# EAGLE schematic source_eagle (EAGLE 9.6.2)
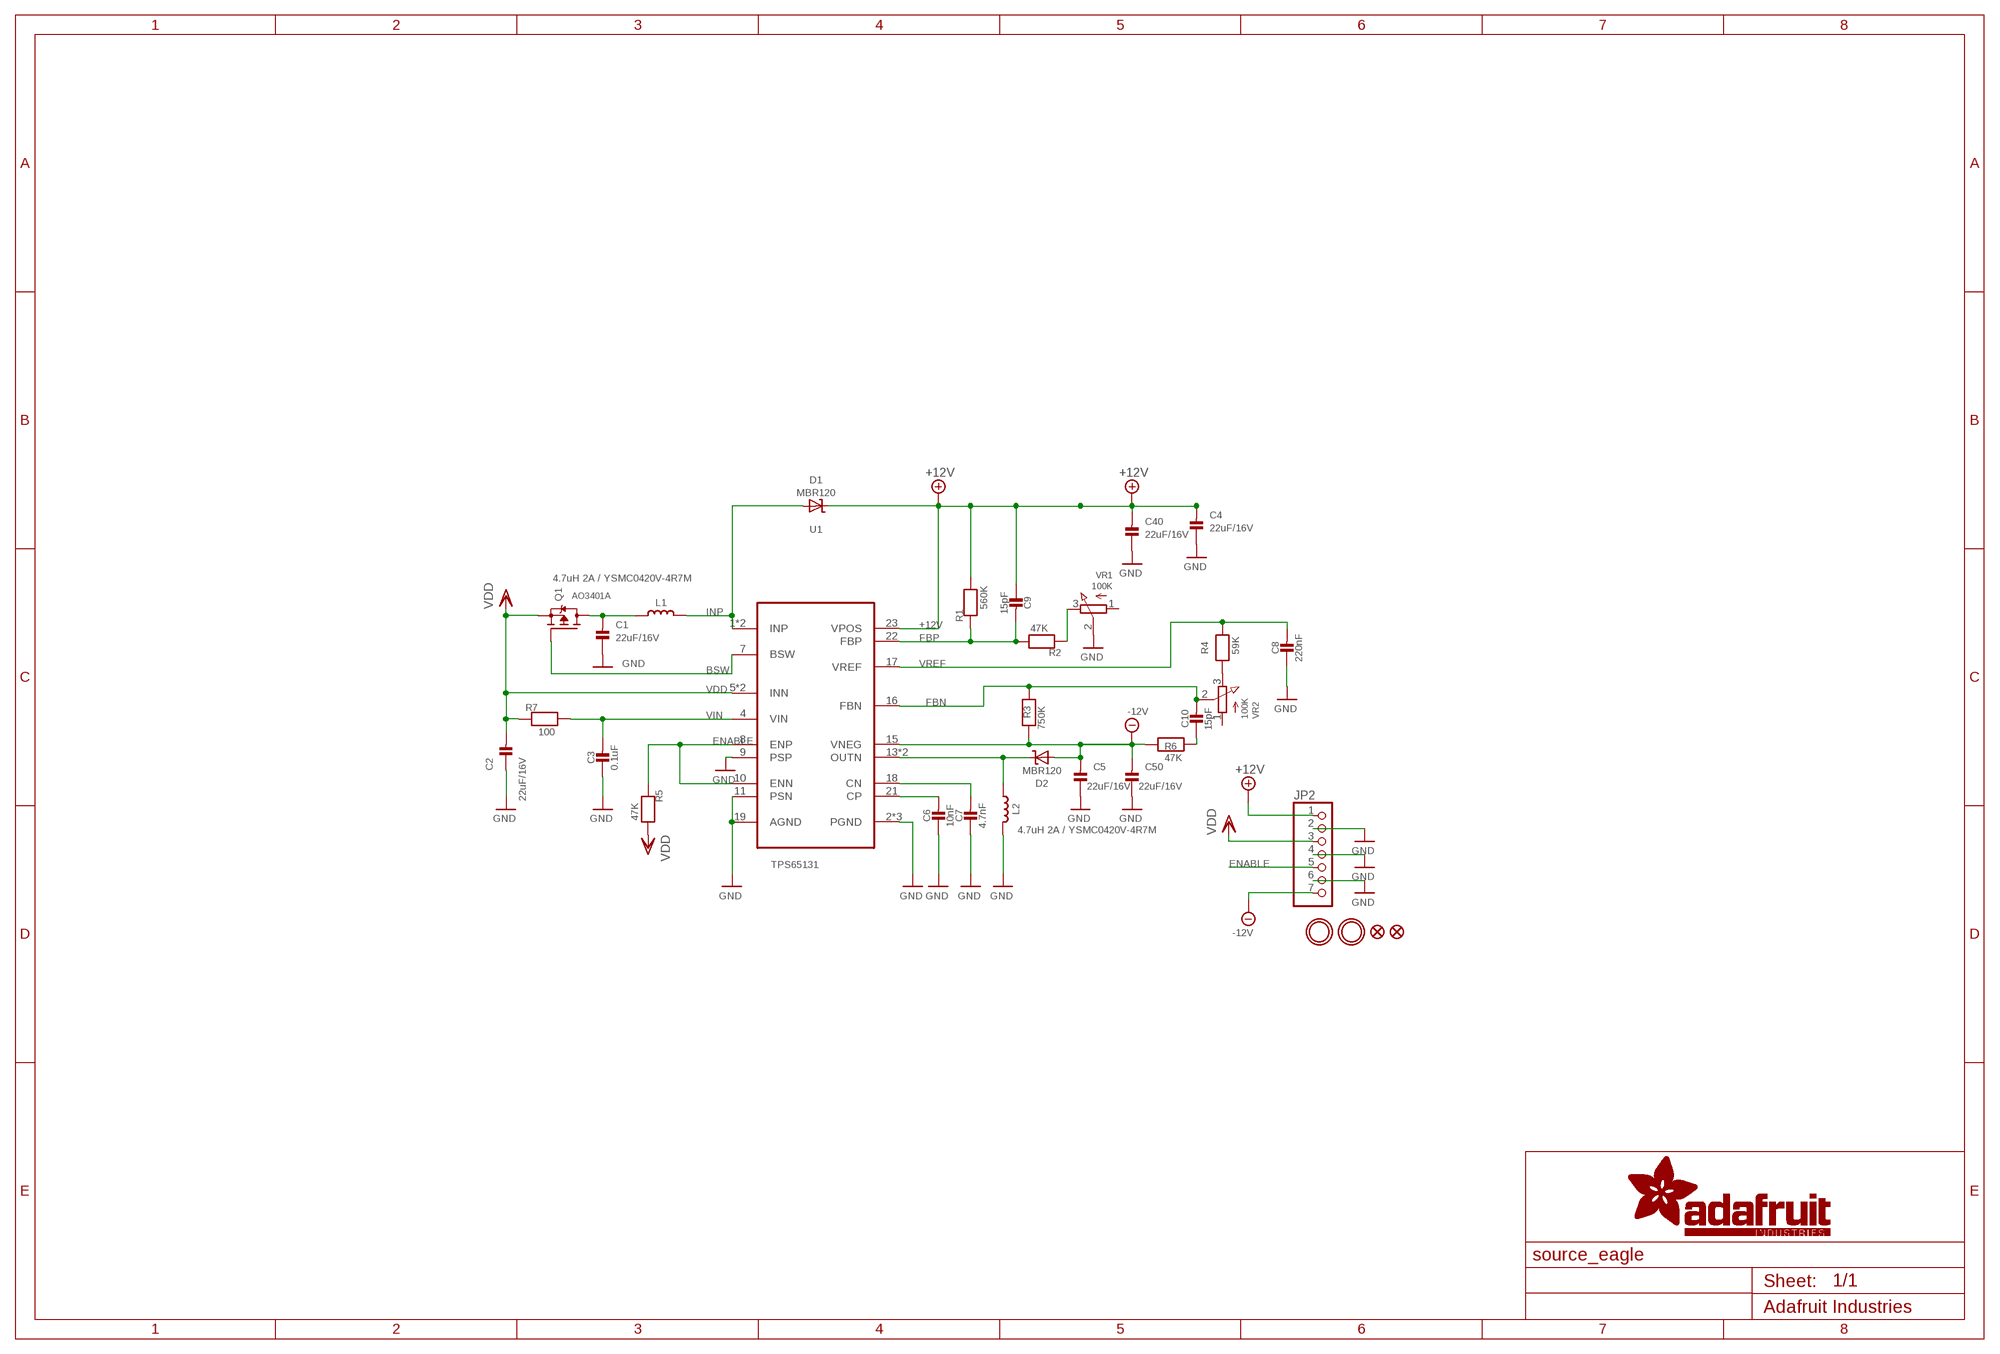
[diagram p0: schematic, sheet 1]

## Parts
C1  22uF/16V  CAP_CERAMIC0805-NOOUTLINE  [0805-NO]
C2  22uF/16V  CAP_CERAMIC0805-NOOUTLINE  [0805-NO]
C3  0.1uF  CAP_CERAMIC0603_NO  [0603-NO]
C4  22uF/16V  CAP_CERAMIC0805-NOOUTLINE  [0805-NO]
C5  22uF/16V  CAP_CERAMIC0805-NOOUTLINE  [0805-NO]
C6  10nF  CAP_CERAMIC0603_NO  [0603-NO]
C7  4.7nF  CAP_CERAMIC0603_NO  [0603-NO]
C8  220nF  CAP_CERAMIC0603_NO  [0603-NO]
C9  15pF  CAP_CERAMIC0603_NO  [0603-NO]
C10  15pF  CAP_CERAMIC0603_NO  [0603-NO]
C40  22uF/16V  CAP_CERAMIC0805-NOOUTLINE  [0805-NO]
C50  22uF/16V  CAP_CERAMIC0805-NOOUTLINE  [0805-NO]
D1  MBR120  DIODE-SCHOTTKYSOD-123FL  [SOD-123FL]
D2  MBR120  DIODE-SCHOTTKYSOD-123FL  [SOD-123FL]
FID1  FIDUCIAL_0.5MM  [FIDUCIAL_0.5MM]
FID2  FIDUCIAL_0.5MM  [FIDUCIAL_0.5MM]
JP2  HEADER-1X7THICKER  [1X07_ROUND_76]
L1  4.7uH 2A / YSMC0420V-4R7M  INDUCTORNR401  [INDUCTOR_4X4MM_NR401]
L2  4.7uH 2A / YSMC0420V-4R7M  INDUCTORNR401  [INDUCTOR_4X4MM_NR401]
Q1  AO3401A  MOSFET-PWIDE  [SOT23-WIDE]
R1  560K  RESISTOR_0603_NOOUT  [0603-NO]
R2  47K  RESISTOR_0603_NOOUT  [0603-NO]
R3  750K  RESISTOR_0603_NOOUT  [0603-NO]
R4  59K  RESISTOR_0603_NOOUT  [0603-NO]
R5  47K  RESISTOR_0603_NOOUT  [0603-NO]
R6  47K  RESISTOR_0603_NOOUT  [0603-NO]
R7  100  RESISTOR_0603_NOOUT  [0603-NO]
U1  TPS65131  TPS6513X  [QFN24_4MM]
U$1  MOUNTINGHOLE2.5  [MOUNTINGHOLE_2.5_PLATED]
U$2  MOUNTINGHOLE2.5  [MOUNTINGHOLE_2.5_PLATED]
VR1  100K  TRIMPOTTC33X-2  [TRIMPOT_BOURNS_TC33X-2]
VR2  100K  TRIMPOTTC33X-2  [TRIMPOT_BOURNS_TC33X-2]

## Nets
+12V: C4.2 C9.1 C40.2 D1.C JP2.1 R1.2 U1.23(VPOS)
-12V: C5.2 C50.2 D2.A JP2.7 R3.1 R6.1 U1.15(VNEG)
BSW: Q1.1(G) U1.7(BSW)
ENABLE: JP2.5 R5.1 U1.8(ENP) U1.10(ENN)
FBN: C10.2 R3.2 U1.16(FBN) VR2.2(S)
FBP: C9.2 R1.1 R2.2 U1.22(FBP)
GND: C1.1 C2.1 C3.1 C4.1 C5.1 C6.1 C7.1 C8.1 C40.1 C50.1 JP2.2 JP2.4 JP2.6 L2.P$2 U1.2(PGND) U1.3(PGND) U1.9(PSP) U1.11(PSN) U1.19(AGND) U1.25(PGND) VR1.2(S)
INP: D1.A L1.P$2 U1.1(INP) U1.24(INP)
N$1: C6.2 U1.21(CP)
N$2: C1.2 L1.P$1 Q1.3(D)
N$3: R2.1 VR1.3(E)
N$4: R4.1 VR2.3(E)
N$5: C10.1 R6.2
N$17: C7.2 U1.18(CN)
OUTN: D2.C L2.P$1 U1.13(OUTN) U1.14(OUTN)
VDD: C2.2 JP2.3 Q1.2(S) R5.2 R7.1 U1.5(INN) U1.6(INN)
VIN: C3.2 R7.2 U1.4(VIN)
VREF: C8.2 R4.2 U1.17(VREF)
Unconnected: VR1.1(A) VR2.1(A)

## Library data of the parts
C1-C10 C40 C50 = microbuilder:CAP_CERAMIC: Ceramic Capacitors For new designs, use the packages preceded by an '_' character since they are more reliable: The following footprints should be used on most boards: _0402 - Standard footprint for regular board layouts _0603 - Standard footprint for regular board layouts _0805 - Standard footprint for regular board layouts _1206 - Standard footprint for regular board layouts For extremely tight-pitch boards where space is at a premium, the following 'micro-pitch' footprints can be used (smaller pads, no silkscreen outline, etc.): _0402MP - Micro-pitch footprint for very dense/compact boards _0603MP - Micro-pitch footprint for very dense/compact boards _0805MP - Micro-pitch footprint for very dense/compact boards _1206MP - Micro-pitch footprint for very dense/compact boards
D1 D2 = microbuilder:DIODE-SCHOTTKY
FID1 FID2 = microbuilder:FIDUCIAL: Fiducial Alignment Points Various fiducial points for machine vision alignment.
JP2 = microbuilder:HEADER-1X7: PIN HEADER
L1 L2 = microbuilder:INDUCTOR: Inductors 0603: 10nH Ceramic Inductor - microwire antenna/RF (Digikey: 712-1434-2-ND) 0805: 560nH Ceramic Inductor - RF (Digikey: 553-1047-1-ND) 270nH Ceramic Inductor - Q = 40@250MHz, +-5%, 1 Ohm DC Resistance (Digikey: 535-10506-2-ND) 1007 (2518 Metric) SMT: 10µH 10% 250mOhm 820mA 1007 Inductor (Digikey: 587-2189-1-ND) 22µH 10% 500mOhm 580mA 1007 Inductor (Digikey: 587-2190-1-ND) 47µH 10% 950mOhm 420mA 1007 Inductor (Digikey: 587-2191-1-ND) 47µH 5% 100mOhm 1A 1008 Inductor (Digikey: 732-1816-1-ND) 5.0x5.0mm (Taiyo Yuden NR5040 Series) 6.8µH 20% 2.3A 64mOhm Inductor (Digikey: 587-2374-2-ND) 5.0x5.0mm (TDK VLC5045 Series) 4.7µH 20% 3.3A 34mOhm Inductor (Digikey: 445-6526-1-ND) 6.8µH 20% 2.7A 46mOhm Inductor (Digikey: 445-6527-1-ND) 6.0x6.0mm (TDK VLC6045 Series) 4.7µH 20% 3.8A 27mOhm Inductor (Digikey: 445-6538-2-ND) 6.8µH 20% 3A 41mOhm Inductor (Digikey: 445-6540-1-ND) 6.2µH 30% 2.2A 45mOhm Inductor (Digikey: SRR5028-6R2YCT-ND) - Not TDK VLC6045 but footprint should match 6.0x6.0mm (TDK SLF6045 Series) 6.8uH 30% 2A 33mOhm Inductor (Digikey: 445-4572-1-ND, Mouser: 810-SLF645T6R8N2R0PF) 6.0x6.0mm (Sumida CDRH5D28 Series) 6.2uH 30% 1.8A 45mOhm Inductor (Digikey: 308-1542-1-ND) Taiyo Yuden NR3015T2R2M - 2.2uH 20% 1.5A (Digikey: 587-1648-2-ND, Mouser: 963-NR3015T2R2M) - Used with TI TPS62172 CoilCraft RFID Transponder Coil - MA5532-AE (For use with AS3935 Lightning Sensor) Taiyo Yuden NRH2412T2R2MNGH - 2.2uH 20% 1AA (Digikey: 587-3443-1-ND) - Used with TI LM3671 Vishay IHLP 1.0uH Molded Inductor - 24mOhm DCR, 5A, +/-20%, -55°C-125°C (Digikey: 541-1319-1-ND)
Q1 = microbuilder:MOSFET-P: P-Channel Mosfet LEGEND VDS: Voltage Drain-Source ID: Drain Current RDS(ON): Drain-Source On-State Resistance VGS(TH): Gate-Source Threshold Voltage CISS: Drain-Source Input Capacitance SOT-23 Name VDS ID RDS(ON) VGS(TH) CISS Order Number IRLML5103 30V 760mA 600 mOhm -- 75pF @ 25V Digikey: IRLML5103PBFCT-ND IRLML6401 12V 4.3A 50 mOhm 950mV @ 250µA 830pF @ 10V Digikey: IRLML6401PBFTR-ND NTR0202PL 20V 400mA 800 mOhm 2.3V @ 250uA 70pF @ 5V Digikey: NTR0202PLT1GOSTR-ND NTR4101PT1G 20V 1.8A 85 mOhm 1.2V @ 250uA 675pF @ 10V Digikey: NTR4101PT1GOSCT-ND DMP2004K 20V 600mA 900 mOhm 1V @ 250uA 175pF @ 16V Digikey: DMP2004KDICT-ND PMV65XP 20V 3.9A 76 mOhm 950mV @ 1mA 725pF @ 20V Digikey: 568-2358-2-ND TO-252 Name VDS ID RDS(ON) VGS(TH) CISS Order Number AOD417 30V 25A 34 mOhm 3V @ 250µA 920pF @ 15V Digikey: 785-1106-2-ND PowerPak Name VDS ID RDS(ON) VGS(TH) CISS Order Number AON7401 30V 12A 14 mOhm 3V @ 250µA 2600pF @ 15V Digikey: 785-1302-1-ND
R1-R7 = microbuilder:RESISTOR: Resistors For new designs, use the packages preceded by an '_' character since they are more reliable: The following footprints should be used on most boards: _0402 - Standard footprint for regular board layouts _0603 - Standard footprint for regular board layouts _0805 - Standard footprint for regular board layouts _1206 - Standard footprint for regular board layouts For extremely tight-pitch boards where space is at a premium, the following 'micro-pitch' footprints can be used (smaller pads, no silkscreen outline, etc.): _0402MP - Micro-pitch footprint for very dense/compact boards _0603MP - Micro-pitch footprint for very dense/compact boards _0805MP - Micro-pitch footprint for very dense/compact boards _1206MP - Micro-pitch footprint for very dense/compact boards
U1 = adafruit_power:TPS6513X: None; MANUFACTURER: Texas Instruments; PACKAGE: QFN50P400X400X100-25N
U$1 U$2 = adafruit_electromech:MOUNTINGHOLE: Mounting Hole For #2 screws (0.086"/2.18mm width, 0.094"/2.4mm hole) use 2.5mm; BOM: EXCLUDE
VR1 VR2 = microbuilder:TRIMPOT: 3-Pin SMT Trimpots Bourns TC33 (X-2) Series 1K - Digikey: TC33X-102ECT-ND 10K - Digikey: TC33X-2-103E 100K - Digikey: TC33X-104ECT-ND Bourns 3303 (W) Series 3mm 10K Single Turn - Digikey: 3303W-103ETR-ND 3mm 100K Single Turn - Digikey: 3303X-104ETR-ND; ROT: 0

## Net classes
3 HIGHPOWER: width 0.254 mm, drill 0.483 mm